# Altium schematic sheet InterfacePagamentos.SchDoc: CONTROLADORA AIRPOPCORN
size A3; DocumentNumber: 15; SheetNumber: 15; SheetTotal: 15
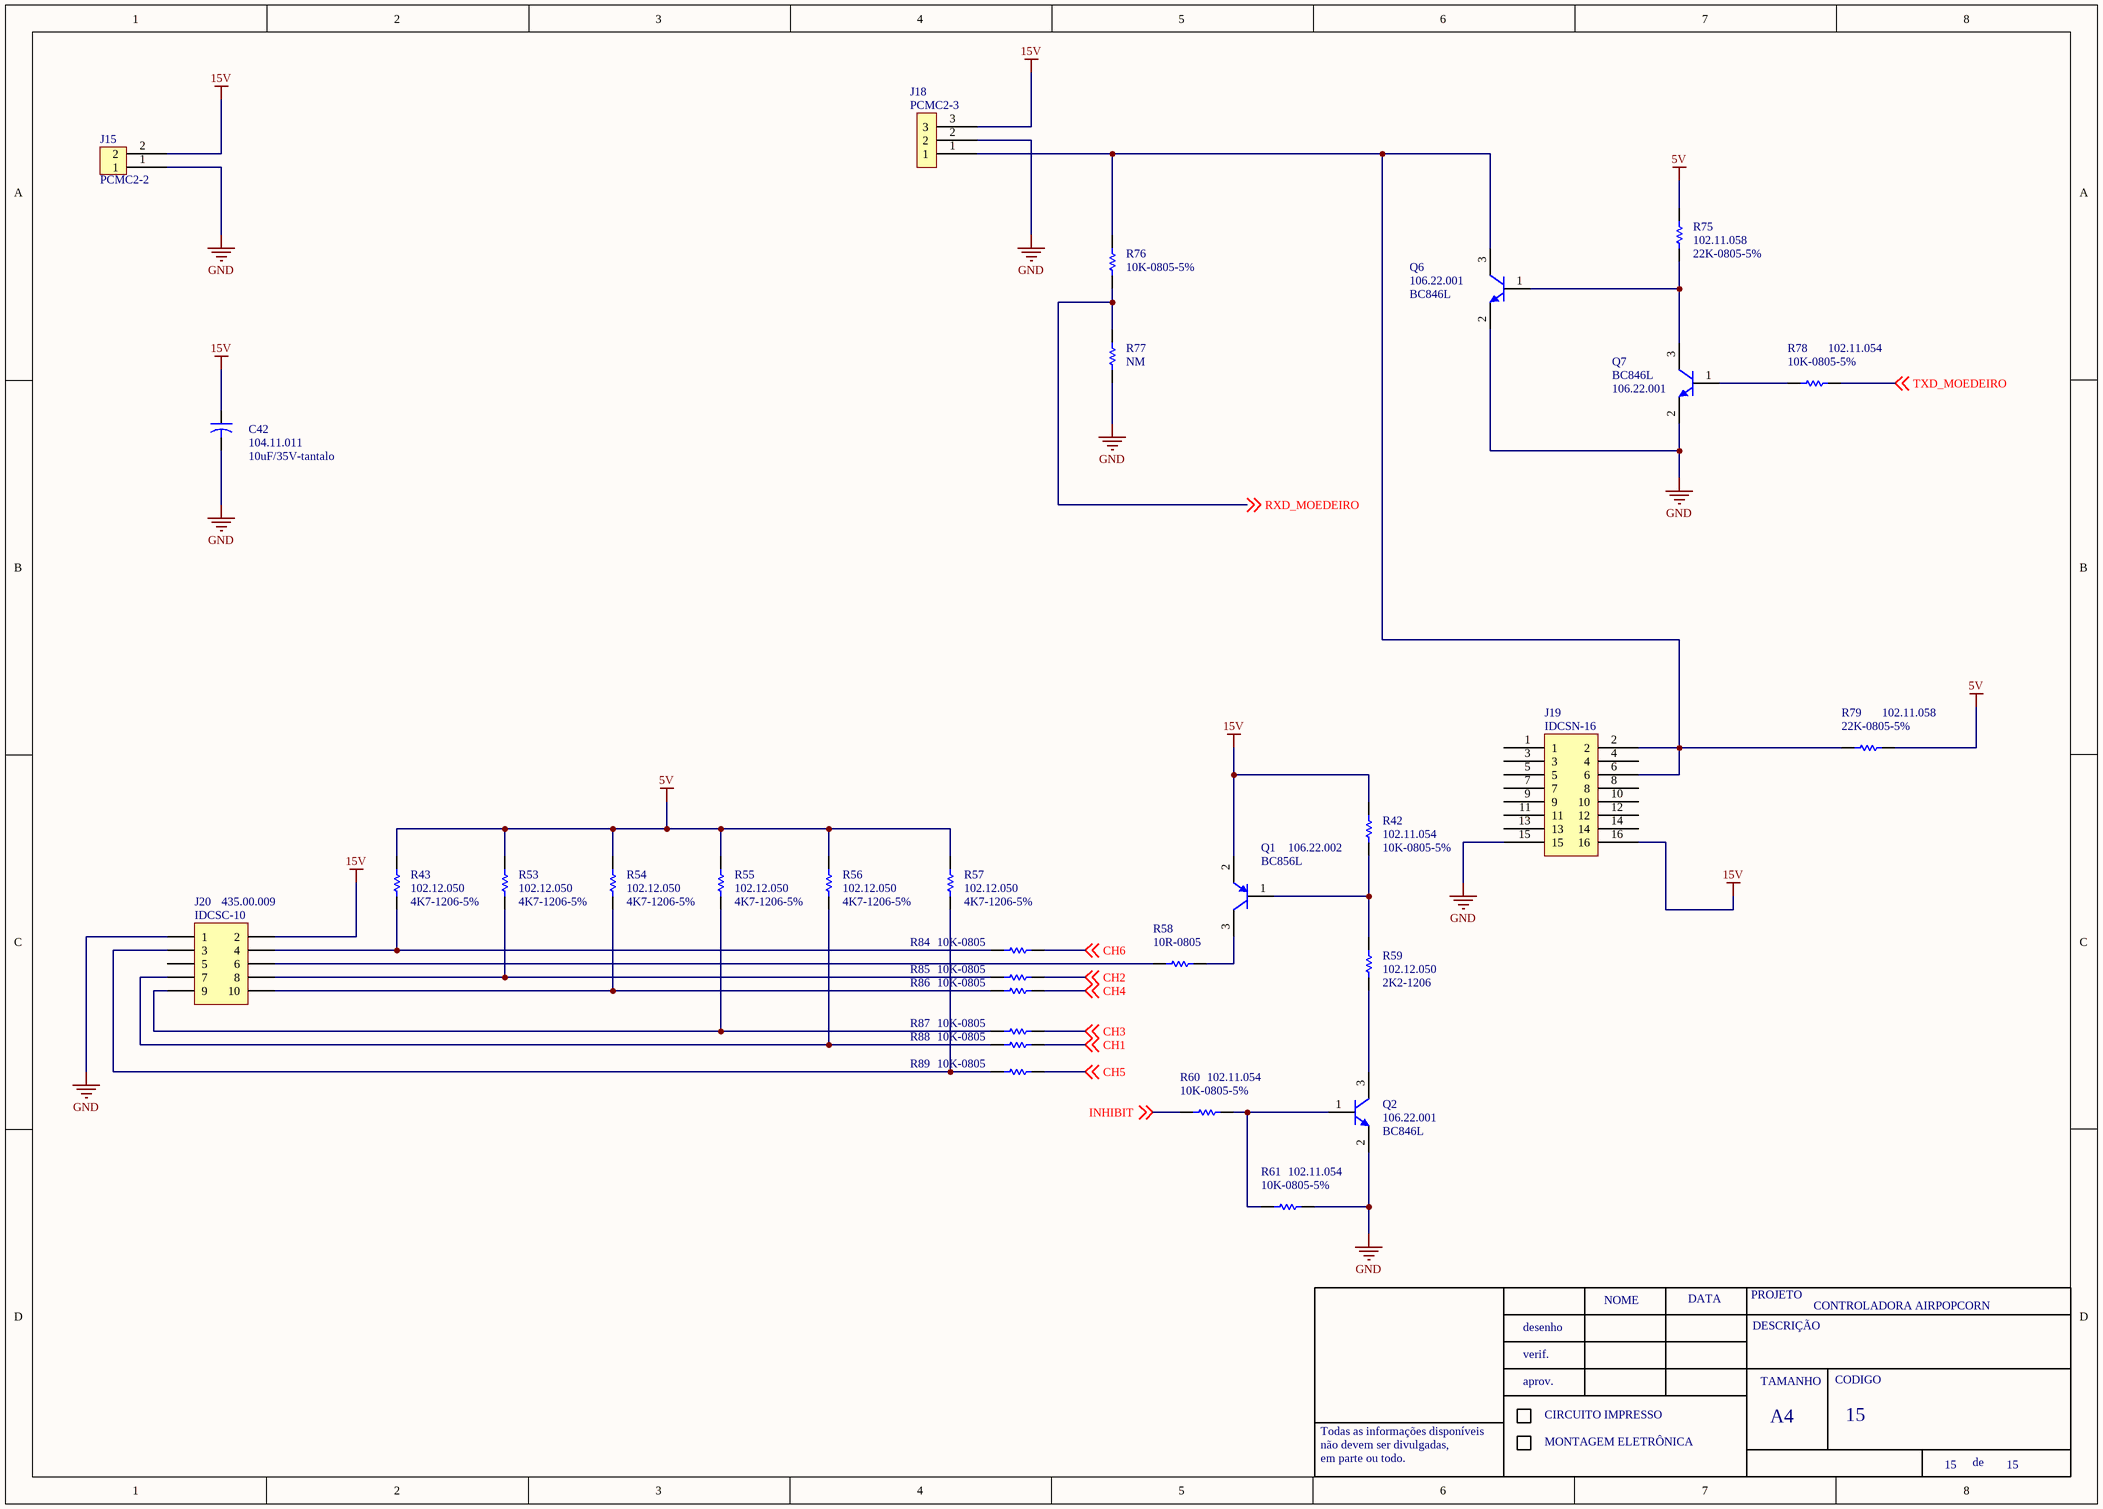
[diagram p0: InterfacePagamentos.SchDoc]

## Parts
C42  10uF/35V-tantalo  ERP: 104.11.011  [CAP 2413 POLARIZADO KEMET]
J15  PCMC2-2  [PCMC2-2]
J18  PCMC2-3  [PCMC2-3]
J19  IDCSN-16  [IDCSC-16]
J20  IDCSC-10  ERP: 435.00.009  [IDCSC-10]
Q1  BC856L  ERP: 106.22.002  [SOT23 - REVISADO ONDA]
Q2  BC846L  ERP: 106.22.001  [SOT23 - REVISADO ONDA]
Q6  BC846L  ERP: 106.22.001  [SOT23 - REVISADO ONDA]
Q7  BC846L  ERP: 106.22.001  [SOT23 - REVISADO ONDA]
R42  10K-0805-5%  ERP: 102.11.054  [0805-REVISADO ONDA]
R43  4K7-1206-5%  ERP: 102.12.050  [0805-REVISADO ONDA]
R53  4K7-1206-5%  ERP: 102.12.050  [0805-REVISADO ONDA]
R54  4K7-1206-5%  ERP: 102.12.050  [0805-REVISADO ONDA]
R55  4K7-1206-5%  ERP: 102.12.050  [0805-REVISADO ONDA]
R56  4K7-1206-5%  ERP: 102.12.050  [0805-REVISADO ONDA]
R57  4K7-1206-5%  ERP: 102.12.050  [0805-REVISADO ONDA]
R58  10R-0805  [1206-REVISADO ONDA]
R59  2K2-1206  ERP: 102.12.050  [0805-REVISADO ONDA]
R60  10K-0805-5%  ERP: 102.11.054  [0805-REVISADO ONDA]
R61  10K-0805-5%  ERP: 102.11.054  [0805-REVISADO ONDA]
R75  22K-0805-5%  ERP: 102.11.058  [0805-REVISADO ONDA]
R76  10K-0805-5%  [0805-REVISADO ONDA]
R77  NM  [0805-REVISADO ONDA]
R78  10K-0805-5%  ERP: 102.11.054  [0805-REVISADO ONDA]
R79  22K-0805-5%  ERP: 102.11.058  [0805-REVISADO ONDA]
R84  10K-0805  [1206-REVISADO ONDA]
R85  10K-0805  [1206-REVISADO ONDA]
R86  10K-0805  [1206-REVISADO ONDA]
R87  10K-0805  [1206-REVISADO ONDA]
R88  10K-0805  [1206-REVISADO ONDA]
R89  10K-0805  [1206-REVISADO ONDA]

## Nets
5V: R43.2 R53.2 R54.2 R55.2 R56.2 R57.2 R75.2 R79.2
15V: C42.1 J15.2 J18.3 J19.16 J20.2 Q1.2(E) R42.2
GND: C42.2 J15.1 J18.2 J19.15 J20.1 Q2.2(E) Q6.2(E) Q7.2(E) R61.2 R77.1
CH1: R88.1 ; off-sheet CH1
CH2: R85.1 ; off-sheet CH2
CH3: R87.1 ; off-sheet CH3
CH4: R86.1 ; off-sheet CH4
CH5: R89.1 ; off-sheet CH5
CH6: R84.1 ; off-sheet CH6
INHIBIT: R60.1 ; off-sheet INHIBIT
RXD_MOEDEIRO: R76.2 R77.2 ; off-sheet RXD_MOEDEIRO
TXD_MOEDEIRO: R78.2 ; off-sheet TXD_MOEDEIRO
NetJ18_1: J18.1 J19.2 J19.6 Q6.3(C) R76.1 R79.1
NetJ20_3: J20.3 R57.1 R89.2
NetJ20_4: J20.4 R43.1 R84.2
NetJ20_6: J20.6 R58.2
NetJ20_7: J20.7 R56.1 R88.2
NetJ20_8: J20.8 R53.1 R85.2
NetJ20_9: J20.9 R55.1 R87.2
NetJ20_10: J20.10 R54.1 R86.2
NetQ1_1: Q1.1(B) R42.1 R59.2
NetQ1_3: Q1.3(C) R58.1
NetQ2_1: Q2.1(B) R60.2 R61.1
NetQ2_3: Q2.3(C) R59.1
NetQ6_1: Q6.1(B) Q7.3(C) R75.1
NetQ7_1: Q7.1(B) R78.1

Not connected (* = marked no-connect by the designer): J19 1 3 4 5 7 8 9 10 11 12 13 14; J20 5

## Notes on the sheet
- NOME
- DATA
- PROJETO
- DESCRIÇÃO
- desenho
- verif.
- aprov.
- TAMANHO
- CODIGO
- Todas as informações disponíveis
- não devem ser divulgadas,
- em parte ou todo.
- CIRCUITO IMPRESSO
- MONTAGEM ELETRÔNICA
- A4
- de

## Library data of the parts
J20 = IDCSN: CONECTOR HEADER 10 VIAS 90º
Q2 Q6 Q7 = BC846
R58 R84-R89 = 10K-0805-5%: ERP: 102.11.054
R59 = 4K7-1206-5%
R76 = 56K-0805-5%: ERP: 102.11.063
R77 = 100K-0805-5%: ERP: 102.11.066